# Altium schematic sheet RK3568-SOM-DDR3_MEM.SchDoc
size A2; DocumentNumber: 3; SheetNumber: 3; SheetTotal: 31
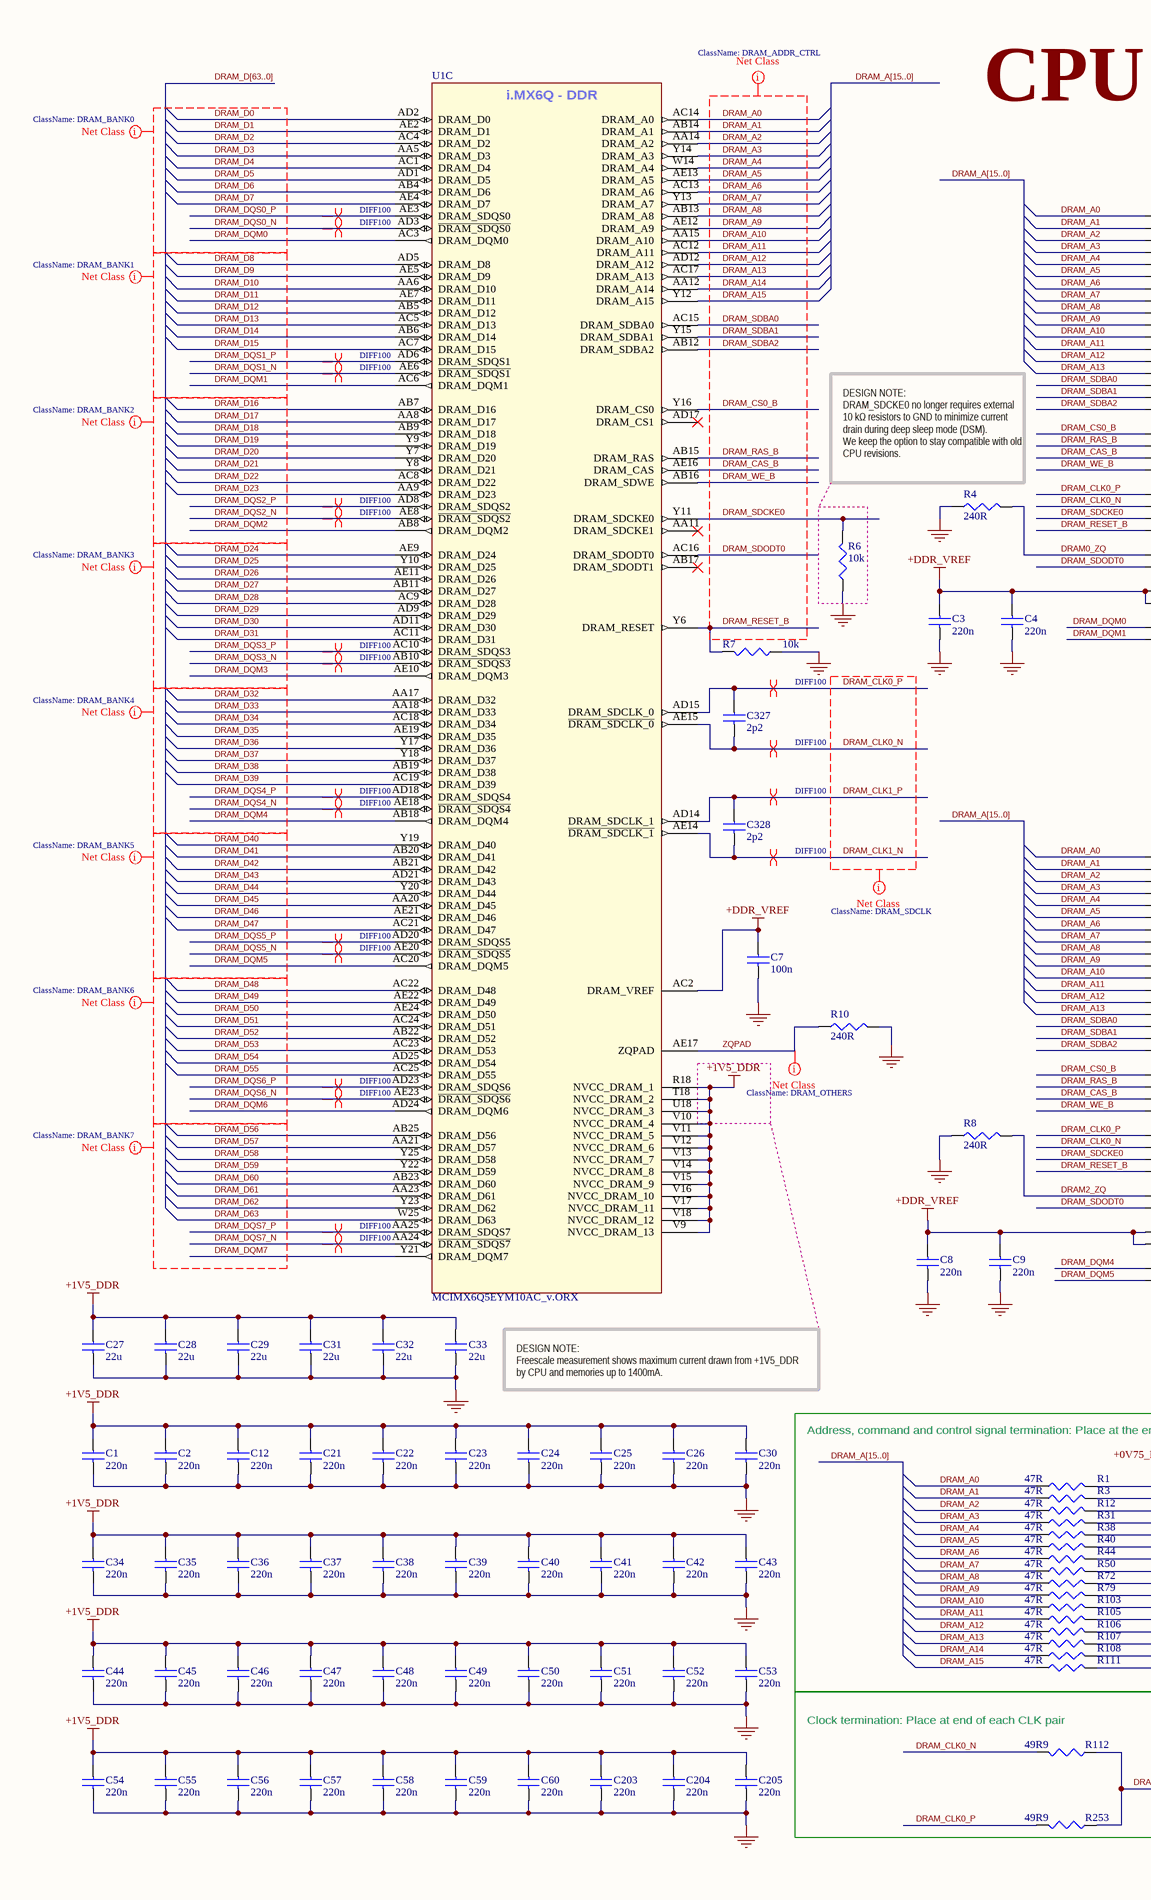
[diagram p0: RK3568-SOM-DDR3_MEM.SchDoc, left]
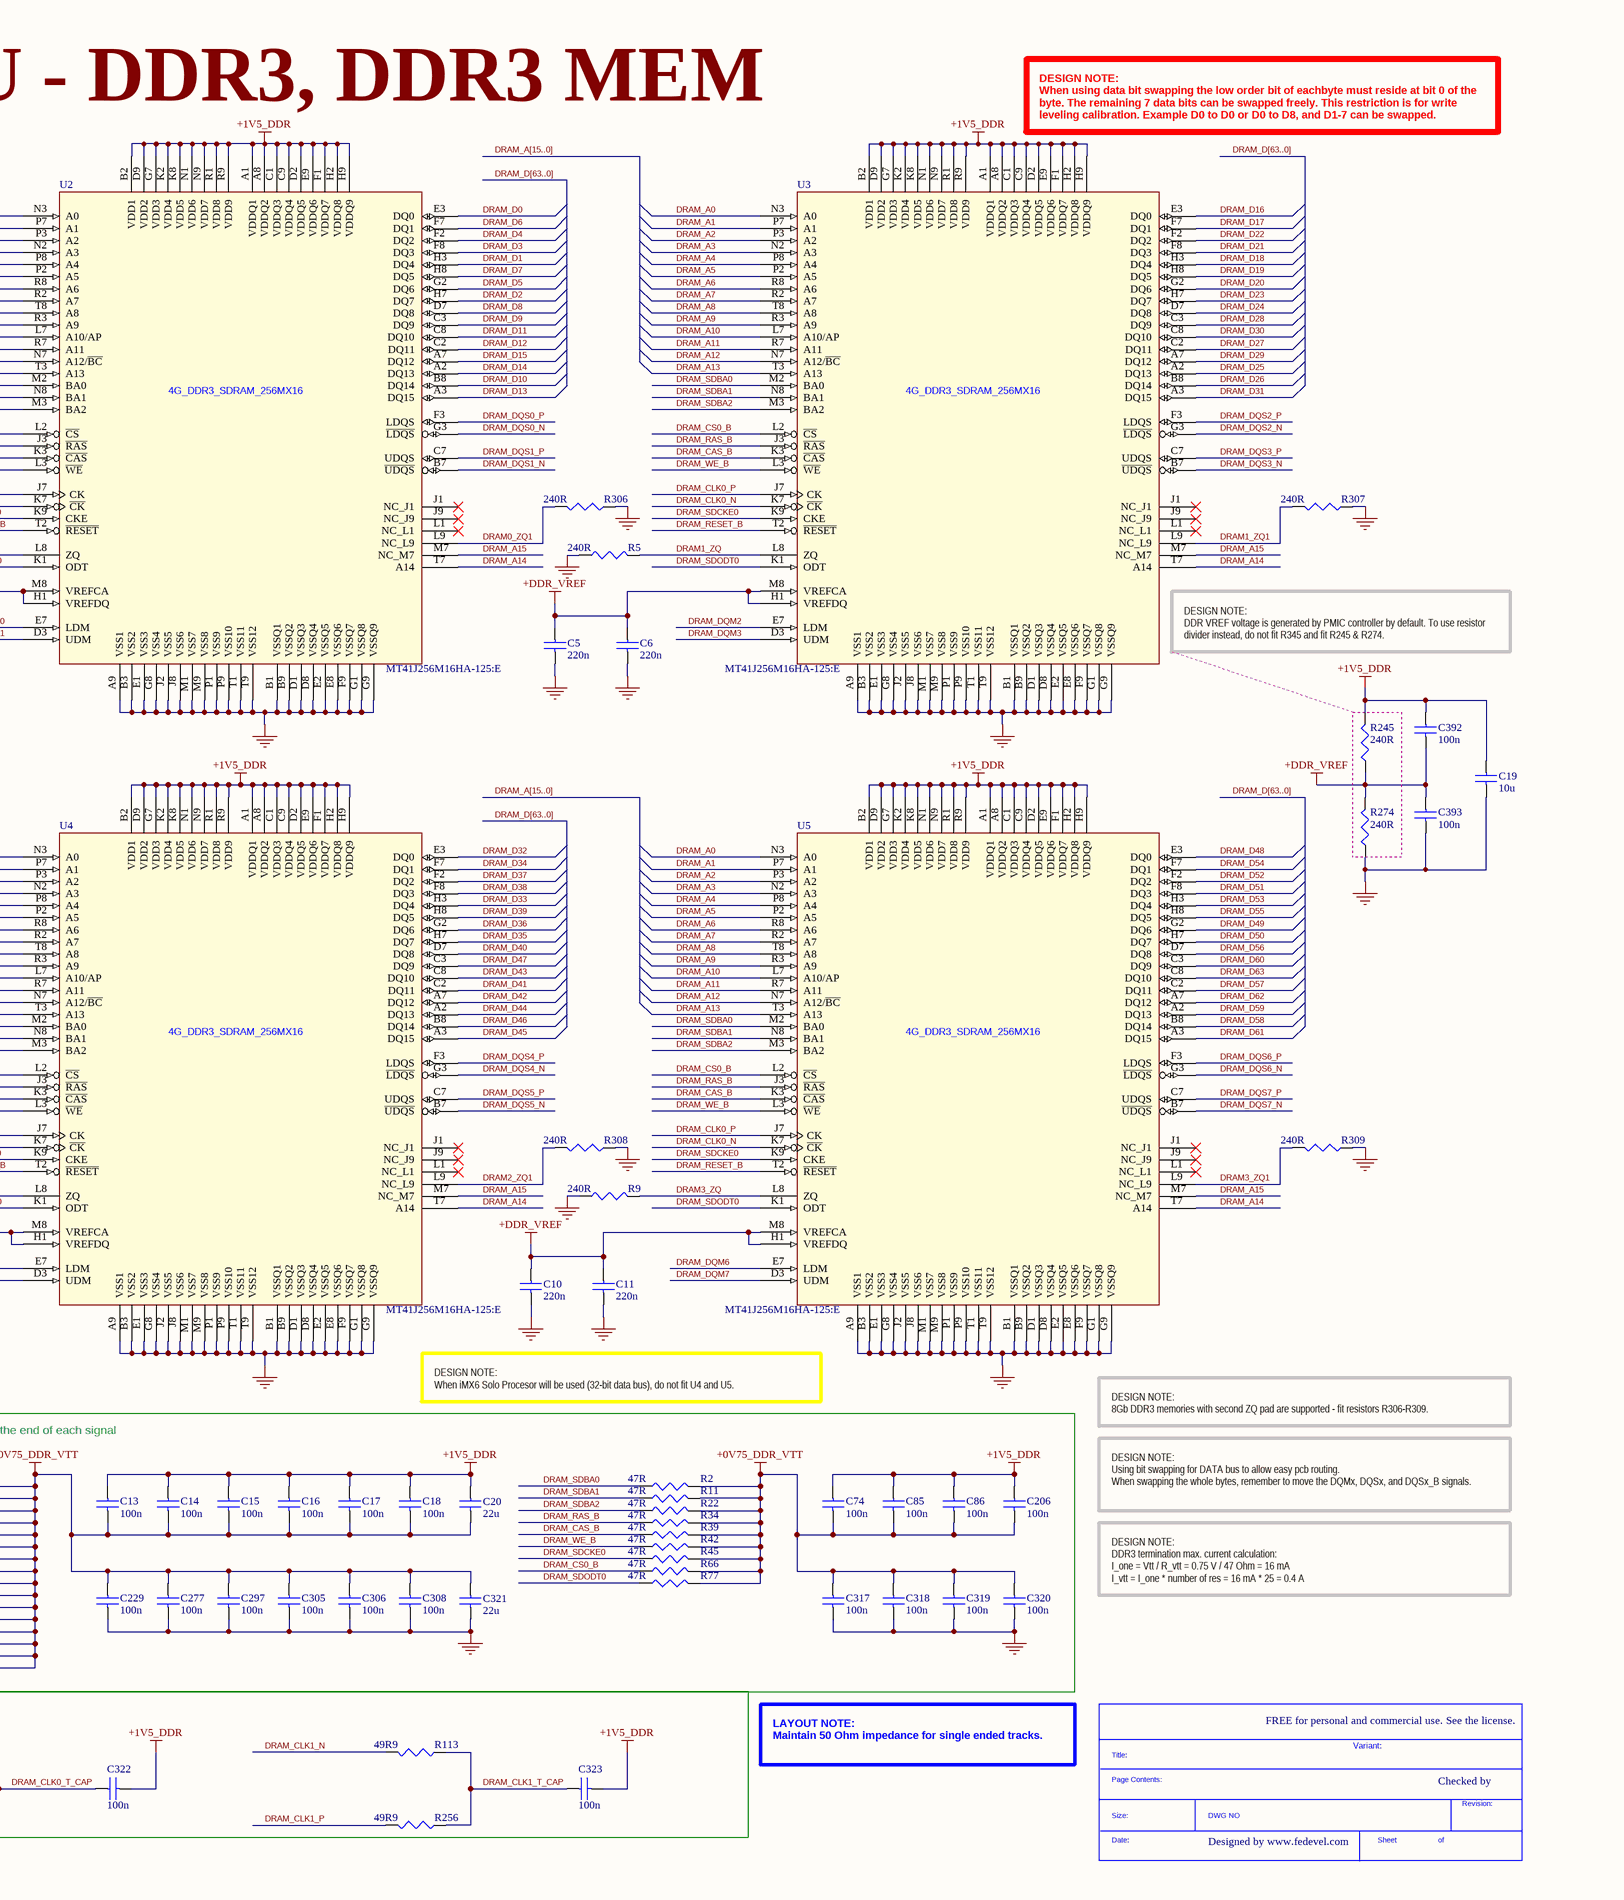
[diagram p1: RK3568-SOM-DDR3_MEM.SchDoc, right]

## Parts
*  SDTitleBlock  (value not drawn)  (graphical)
C1  220n  [C0201]
C2  220n  [C0201]
C3  220n  [C0201]
C4  220n  [C0201]
C5  220n  [C0201]
C6  220n  [C0201]
C7  100n  [C0201]
C8  220n  [C0201]
C9  220n  [C0201]
C10  220n  [C0201]
C11  220n  [C0201]
C12  220n  [C0201]
C13  100n  [C0201]
C14  100n  [C0201]
C15  100n  [C0201]
C16  100n  [C0201]
C17  100n  [C0201]
C18  100n  [C0201]
C19  10u  [C0603]
C20  22u  [C0603]
C21  220n  [C0201]
C22  220n  [C0201]
C23  220n  [C0201]
C24  220n  [C0201]
C25  220n  [C0201]
C26  220n  [C0201]
C27  22u  [C0603]
C28  22u  [C0603]
C29  22u  [C0603]
C30  220n  [C0201]
C31  22u  [C0603]
C32  22u  [C0603]
C33  22u  [C0603]
C34  220n  [C0201]
C35  220n  [C0201]
C36  220n  [C0201]
C37  220n  [C0201]
C38  220n  [C0201]
C39  220n  [C0201]
C40  220n  [C0201]
C41  220n  [C0201]
C42  220n  [C0201]
C43  220n  [C0201]
C44  220n  [C0201]
C45  220n  [C0201]
C46  220n  [C0201]
C47  220n  [C0201]
C48  220n  [C0201]
C49  220n  [C0201]
C50  220n  [C0201]
C51  220n  [C0201]
C52  220n  [C0201]
C53  220n  [C0201]
C54  220n  [C0201]
C55  220n  [C0201]
C56  220n  [C0201]
C57  220n  [C0201]
C58  220n  [C0201]
C59  220n  [C0201]
C60  220n  [C0201]
C74  100n  [C0201]
C85  100n  [C0201]
C86  100n  [C0201]
C203  220n  [C0201]
C204  220n  [C0201]
C205  220n  [C0201]
C206  100n  [C0201]
C229  100n  [C0201]
C277  100n  [C0201]
C297  100n  [C0201]
C305  100n  [C0201]
C306  100n  [C0201]
C308  100n  [C0201]
C317  100n  [C0201]
C318  100n  [C0201]
C319  100n  [C0201]
C320  100n  [C0201]
C321  22u  [C0603]
C322  100n  [C0201]
C323  100n  [C0201]
C327  2p2  [C0201]
C328  2p2  [C0201]
C392  100n  [C0402]
C393  100n  [C0402]
R1  47R  [R0201]
R2  47R  [R0201]
R3  47R  [R0201]
R4  240R  [R0201]
R5  240R  [R0201]
R6  10k  [R0201]
R7  10k  [R0201]
R8  240R  [R0201]
R9  240R  [R0201]
R10  240R  [R0201]
R11  47R  [R0201]
R12  47R  [R0201]
R22  47R  [R0201]
R31  47R  [R0201]
R34  47R  [R0201]
R38  47R  [R0201]
R39  47R  [R0201]
R40  47R  [R0201]
R42  47R  [R0201]
R44  47R  [R0201]
R45  47R  [R0201]
R50  47R  [R0201]
R66  47R  [R0201]
R72  47R  [R0201]
R77  47R  [R0201]
R79  47R  [R0201]
R103  47R  [R0201]
R105  47R  [R0201]
R106  47R  [R0201]
R107  47R  [R0201]
R108  47R  [R0201]
R111  47R  [R0201]
R112  49R9  [R0201]
R113  49R9  [R0201]
R245  240R  [R0402]
R253  49R9  [R0201]
R256  49R9  [R0201]
R274  240R  [R0402]
R306  240R  [R0201]
R307  240R  [R0201]
R308  240R  [R0201]
R309  240R  [R0201]
U1  MCIMX6Q5EYM10AC_v.ORX  [PBGA624]  (part C of 21)
U2  MT41J256M16HA-125:E  [96_FPGA_DD3_14mmx10mm-small_size]
U3  MT41J256M16HA-125:E  [96_FPGA_DD3_14mmx10mm-small_size]
U4  MT41J256M16HA-125:E  [96_FPGA_DD3_14mmx10mm-small_size]
U5  MT41J256M16HA-125:E  [96_FPGA_DD3_14mmx10mm-small_size]

## Blocks framed on the sheet
Clock termination: Place at end of each CLK pair: C322 C323 R112 R113 R253 R256

## Nets
+0V75_DDR_VTT: C13.2 C14.2 C15.2 C16.2 C17.2 C18.2 C20.2 C74.2 C85.2 C86.2 C206.2 C229.1 C277.1 C297.1 C305.1 C306.1 C308.1 C317.1 C318.1 C319.1 C320.1 C321.1 R1.2 R2.2 R3.2 R11.2 R12.2 R22.2 R31.2 R34.2 R38.2 R39.2 R40.2 R42.2 R44.2 R45.2 R50.2 R66.2 R72.2 R77.2 R79.2 R103.2 R105.2 R106.2 R107.2 R108.2 R111.2
+1V5_DDR: C1.1 C2.1 C12.1 C13.1 C14.1 C15.1 C16.1 C17.1 C18.1 C19.1 C20.1 C21.1 C22.1 C23.1 C24.1 C25.1 C26.1 C27.1 C28.1 C29.1 C30.1 C31.1 C32.1 C33.1 C34.1 C35.1 C36.1 C37.1 C38.1 C39.1 C40.1 C41.1 C42.1 C43.1 C44.1 C45.1 C46.1 C47.1 C48.1 C49.1 C50.1 C51.1 C52.1 C53.1 C54.1 C55.1 C56.1 C57.1 C58.1 C59.1 C60.1 C74.1 C85.1 C86.1 C203.1 C204.1 C205.1 C206.1 C322.2 C323.2 C392.1 R245.2 U1.R18(NVCC_DRAM_1) U1.T18(NVCC_DRAM_2) U1.U18(NVCC_DRAM_3) U1.V9(NVCC_DRAM_13) U1.V10(NVCC_DRAM_4) U1.V11(NVCC_DRAM_5) U1.V12(NVCC_DRAM_6) U1.V13(NVCC_DRAM_7) U1.V14(NVCC_DRAM_8) U1.V15(NVCC_DRAM_9) U1.V16(NVCC_DRAM_10) U1.V17(NVCC_DRAM_11) U1.V18(NVCC_DRAM_12) U2.A1(VDDQ1) U2.A8(VDDQ2) U2.B2(VDD1) U2.C1(VDDQ3) U2.C9(VDDQ4) U2.D2(VDDQ5) U2.D9(VDD2) U2.E9(VDDQ6) U2.F1(VDDQ7) U2.G7(VDD3) U2.H2(VDDQ8) U2.H9(VDDQ9) U2.K2(VDD4) U2.K8(VDD5) U2.N1(VDD6) U2.N9(VDD7) U2.R1(VDD8) U2.R9(VDD9) U3.A1(VDDQ1) U3.A8(VDDQ2) U3.B2(VDD1) U3.C1(VDDQ3) U3.C9(VDDQ4) U3.D2(VDDQ5) U3.D9(VDD2) U3.E9(VDDQ6) U3.F1(VDDQ7) U3.G7(VDD3) U3.H2(VDDQ8) U3.H9(VDDQ9) U3.K2(VDD4) U3.K8(VDD5) U3.N1(VDD6) U3.N9(VDD7) U3.R1(VDD8) U3.R9(VDD9) U4.A1(VDDQ1) U4.A8(VDDQ2) U4.B2(VDD1) U4.C1(VDDQ3) U4.C9(VDDQ4) U4.D2(VDDQ5) U4.D9(VDD2) U4.E9(VDDQ6) U4.F1(VDDQ7) U4.G7(VDD3) U4.H2(VDDQ8) U4.H9(VDDQ9) U4.K2(VDD4) U4.K8(VDD5) U4.N1(VDD6) U4.N9(VDD7) U4.R1(VDD8) U4.R9(VDD9) U5.A1(VDDQ1) U5.A8(VDDQ2) U5.B2(VDD1) U5.C1(VDDQ3) U5.C9(VDDQ4) U5.D2(VDDQ5) U5.D9(VDD2) U5.E9(VDDQ6) U5.F1(VDDQ7) U5.G7(VDD3) U5.H2(VDDQ8) U5.H9(VDDQ9) U5.K2(VDD4) U5.K8(VDD5) U5.N1(VDD6) U5.N9(VDD7) U5.R1(VDD8) U5.R9(VDD9)
+DDR_VREF: C3.1 C4.1 C5.1 C6.1 C7.1 C8.1 C9.1 C10.1 C11.1 C392.2 C393.1 R245.1 R274.2 U1.AC2(DRAM_VREF) U2.H1(VREFDQ) U2.M8(VREFCA) U3.H1(VREFDQ) U3.M8(VREFCA) U4.H1(VREFDQ) U4.M8(VREFCA) U5.H1(VREFDQ) U5.M8(VREFCA)
GND: C1.2 C2.2 C3.2 C4.2 C5.2 C6.2 C7.2 C8.2 C9.2 C10.2 C11.2 C12.2 C19.2 C21.2 C22.2 C23.2 C24.2 C25.2 C26.2 C27.2 C28.2 C29.2 C30.2 C31.2 C32.2 C33.2 C34.2 C35.2 C36.2 C37.2 C38.2 C39.2 C40.2 C41.2 C42.2 C43.2 C44.2 C45.2 C46.2 C47.2 C48.2 C49.2 C50.2 C51.2 C52.2 C53.2 C54.2 C55.2 C56.2 C57.2 C58.2 C59.2 C60.2 C203.2 C204.2 C205.2 C229.2 C277.2 C297.2 C305.2 C306.2 C308.2 C317.2 C318.2 C319.2 C320.2 C321.2 C393.2 R4.1 R5.1 R6.1 R7.1 R8.1 R9.1 R10.2 R274.1 R306.1 R307.1 R308.1 R309.1 U2.A9(VSS1) U2.B1(VSSQ1) U2.B3(VSS2) U2.B9(VSSQ2) U2.D1(VSSQ3) U2.D8(VSSQ4) U2.E1(VSS3) U2.E2(VSSQ5) U2.E8(VSSQ6) U2.F9(VSSQ7) U2.G1(VSSQ8) U2.G8(VSS4) U2.G9(VSSQ9) U2.J2(VSS5) U2.J8(VSS6) U2.M1(VSS7) U2.M9(VSS8) U2.P1(VSS9) U2.P9(VSS10) U2.T1(VSS11) U2.T9(VSS12) U3.A9(VSS1) U3.B1(VSSQ1) U3.B3(VSS2) U3.B9(VSSQ2) U3.D1(VSSQ3) U3.D8(VSSQ4) U3.E1(VSS3) U3.E2(VSSQ5) U3.E8(VSSQ6) U3.F9(VSSQ7) U3.G1(VSSQ8) U3.G8(VSS4) U3.G9(VSSQ9) U3.J2(VSS5) U3.J8(VSS6) U3.M1(VSS7) U3.M9(VSS8) U3.P1(VSS9) U3.P9(VSS10) U3.T1(VSS11) U3.T9(VSS12) U4.A9(VSS1) U4.B1(VSSQ1) U4.B3(VSS2) U4.B9(VSSQ2) U4.D1(VSSQ3) U4.D8(VSSQ4) U4.E1(VSS3) U4.E2(VSSQ5) U4.E8(VSSQ6) U4.F9(VSSQ7) U4.G1(VSSQ8) U4.G8(VSS4) U4.G9(VSSQ9) U4.J2(VSS5) U4.J8(VSS6) U4.M1(VSS7) U4.M9(VSS8) U4.P1(VSS9) U4.P9(VSS10) U4.T1(VSS11) U4.T9(VSS12) U5.A9(VSS1) U5.B1(VSSQ1) U5.B3(VSS2) U5.B9(VSSQ2) U5.D1(VSSQ3) U5.D8(VSSQ4) U5.E1(VSS3) U5.E2(VSSQ5) U5.E8(VSSQ6) U5.F9(VSSQ7) U5.G1(VSSQ8) U5.G8(VSS4) U5.G9(VSSQ9) U5.J2(VSS5) U5.J8(VSS6) U5.M1(VSS7) U5.M9(VSS8) U5.P1(VSS9) U5.P9(VSS10) U5.T1(VSS11) U5.T9(VSS12)
DRAM0_ZQ: R4.2 U2.L8(ZQ)
DRAM0_ZQ1: R306.2 U2.L9(NC_L9)
DRAM1_ZQ: R5.2 U3.L8(ZQ)
DRAM1_ZQ1: R307.2 U3.L9(NC_L9)
DRAM2_ZQ: R8.2 U4.L8(ZQ)
DRAM2_ZQ1: R308.2 U4.L9(NC_L9)
DRAM3_ZQ: R9.2 U5.L8(ZQ)
DRAM3_ZQ1: R309.2 U5.L9(NC_L9)
DRAM_A0: R1.1 U1.AC14(DRAM_A0) U2.N3(A0) U3.N3(A0) U4.N3(A0) U5.N3(A0)
DRAM_A1: R3.1 U1.AB14(DRAM_A1) U2.P7(A1) U3.P7(A1) U4.P7(A1) U5.P7(A1)
DRAM_A2: R12.1 U1.AA14(DRAM_A2) U2.P3(A2) U3.P3(A2) U4.P3(A2) U5.P3(A2)
DRAM_A3: R31.1 U1.Y14(DRAM_A3) U2.N2(A3) U3.N2(A3) U4.N2(A3) U5.N2(A3)
DRAM_A4: R38.1 U1.W14(DRAM_A4) U2.P8(A4) U3.P8(A4) U4.P8(A4) U5.P8(A4)
DRAM_A5: R40.1 U1.AE13(DRAM_A5) U2.P2(A5) U3.P2(A5) U4.P2(A5) U5.P2(A5)
DRAM_A6: R44.1 U1.AC13(DRAM_A6) U2.R8(A6) U3.R8(A6) U4.R8(A6) U5.R8(A6)
DRAM_A7: R50.1 U1.Y13(DRAM_A7) U2.R2(A7) U3.R2(A7) U4.R2(A7) U5.R2(A7)
DRAM_A8: R72.1 U1.AB13(DRAM_A8) U2.T8(A8) U3.T8(A8) U4.T8(A8) U5.T8(A8)
DRAM_A9: R79.1 U1.AE12(DRAM_A9) U2.R3(A9) U3.R3(A9) U4.R3(A9) U5.R3(A9)
DRAM_A10: R103.1 U1.AA15(DRAM_A10) U2.L7(A10/AP) U3.L7(A10/AP) U4.L7(A10/AP) U5.L7(A10/AP)
DRAM_A11: R105.1 U1.AC12(DRAM_A11) U2.R7(A11) U3.R7(A11) U4.R7(A11) U5.R7(A11)
DRAM_A12: R106.1 U1.AD12(DRAM_A12) U2.N7(A12/~{BC}) U3.N7(A12/~{BC}) U4.N7(A12/~{BC}) U5.N7(A12/~{BC})
DRAM_A13: R107.1 U1.AC17(DRAM_A13) U2.T3(A13) U3.T3(A13) U4.T3(A13) U5.T3(A13)
DRAM_A14: R108.1 U1.AA12(DRAM_A14) U2.T7(A14) U3.T7(A14) U4.T7(A14) U5.T7(A14)
DRAM_A15: R111.1 U1.Y12(DRAM_A15) U2.M7(NC_M7) U3.M7(NC_M7) U4.M7(NC_M7) U5.M7(NC_M7)
DRAM_CAS_B: R39.1 U1.AE16(DRAM_CAS) U2.K3(~{CAS}) U3.K3(~{CAS}) U4.K3(~{CAS}) U5.K3(~{CAS})
DRAM_CLK0_N: C327.2 R112.2 U1.AE15(~{DRAM_SDCLK_0}) U2.K7(~{CK}) U3.K7(~{CK}) U4.K7(~{CK}) U5.K7(~{CK})
DRAM_CLK0_P: C327.1 R253.2 U1.AD15(DRAM_SDCLK_0) U2.J7(CK) U3.J7(CK) U4.J7(CK) U5.J7(CK)
DRAM_CLK0_T_CAP: C322.1 R112.1 R253.1
DRAM_CLK1_N: C328.2 R113.2 U1.AE14(~{DRAM_SDCLK_1})
DRAM_CLK1_P: C328.1 R256.2 U1.AD14(DRAM_SDCLK_1)
DRAM_CLK1_T_CAP: C323.1 R113.1 R256.1
DRAM_CS0_B: R66.1 U1.Y16(DRAM_CS0) U2.L2(~{CS}) U3.L2(~{CS}) U4.L2(~{CS}) U5.L2(~{CS})
DRAM_D0: U1.AD2(DRAM_D0) U2.E3(DQ0)
DRAM_D1: U1.AE2(DRAM_D1) U2.H3(DQ4)
DRAM_D2: U1.AC4(DRAM_D2) U2.H7(DQ7)
DRAM_D3: U1.AA5(DRAM_D3) U2.F8(DQ3)
DRAM_D4: U1.AC1(DRAM_D4) U2.F2(DQ2)
DRAM_D5: U1.AD1(DRAM_D5) U2.G2(DQ6)
DRAM_D6: U1.AB4(DRAM_D6) U2.F7(DQ1)
DRAM_D7: U1.AE4(DRAM_D7) U2.H8(DQ5)
DRAM_D8: U1.AD5(DRAM_D8) U2.D7(DQ8)
DRAM_D9: U1.AE5(DRAM_D9) U2.C3(DQ9)
DRAM_D10: U1.AA6(DRAM_D10) U2.B8(DQ14)
DRAM_D11: U1.AE7(DRAM_D11) U2.C8(DQ10)
DRAM_D12: U1.AB5(DRAM_D12) U2.C2(DQ11)
DRAM_D13: U1.AC5(DRAM_D13) U2.A3(DQ15)
DRAM_D14: U1.AB6(DRAM_D14) U2.A2(DQ13)
DRAM_D15: U1.AC7(DRAM_D15) U2.A7(DQ12)
DRAM_D16: U1.AB7(DRAM_D16) U3.E3(DQ0)
DRAM_D17: U1.AA8(DRAM_D17) U3.F7(DQ1)
DRAM_D18: U1.AB9(DRAM_D18) U3.H3(DQ4)
DRAM_D19: U1.Y9(DRAM_D19) U3.H8(DQ5)
DRAM_D20: U1.Y7(DRAM_D20) U3.G2(DQ6)
DRAM_D21: U1.Y8(DRAM_D21) U3.F8(DQ3)
DRAM_D22: U1.AC8(DRAM_D22) U3.F2(DQ2)
DRAM_D23: U1.AA9(DRAM_D23) U3.H7(DQ7)
DRAM_D24: U1.AE9(DRAM_D24) U3.D7(DQ8)
DRAM_D25: U1.Y10(DRAM_D25) U3.A2(DQ13)
DRAM_D26: U1.AE11(DRAM_D26) U3.B8(DQ14)
DRAM_D27: U1.AB11(DRAM_D27) U3.C2(DQ11)
DRAM_D28: U1.AC9(DRAM_D28) U3.C3(DQ9)
DRAM_D29: U1.AD9(DRAM_D29) U3.A7(DQ12)
DRAM_D30: U1.AD11(DRAM_D30) U3.C8(DQ10)
DRAM_D31: U1.AC11(DRAM_D31) U3.A3(DQ15)
DRAM_D32: U1.AA17(DRAM_D32) U4.E3(DQ0)
DRAM_D33: U1.AA18(DRAM_D33) U4.H3(DQ4)
DRAM_D34: U1.AC18(DRAM_D34) U4.F7(DQ1)
DRAM_D35: U1.AE19(DRAM_D35) U4.H7(DQ7)
DRAM_D36: U1.Y17(DRAM_D36) U4.G2(DQ6)
DRAM_D37: U1.Y18(DRAM_D37) U4.F2(DQ2)
DRAM_D38: U1.AB19(DRAM_D38) U4.F8(DQ3)
DRAM_D39: U1.AC19(DRAM_D39) U4.H8(DQ5)
DRAM_D40: U1.Y19(DRAM_D40) U4.D7(DQ8)
DRAM_D41: U1.AB20(DRAM_D41) U4.C2(DQ11)
DRAM_D42: U1.AB21(DRAM_D42) U4.A7(DQ12)
DRAM_D43: U1.AD21(DRAM_D43) U4.C8(DQ10)
DRAM_D44: U1.Y20(DRAM_D44) U4.A2(DQ13)
DRAM_D45: U1.AA20(DRAM_D45) U4.A3(DQ15)
DRAM_D46: U1.AE21(DRAM_D46) U4.B8(DQ14)
DRAM_D47: U1.AC21(DRAM_D47) U4.C3(DQ9)
DRAM_D48: U1.AC22(DRAM_D48) U5.E3(DQ0)
DRAM_D49: U1.AE22(DRAM_D49) U5.G2(DQ6)
DRAM_D50: U1.AE24(DRAM_D50) U5.H7(DQ7)
DRAM_D51: U1.AC24(DRAM_D51) U5.F8(DQ3)
DRAM_D52: U1.AB22(DRAM_D52) U5.F2(DQ2)
DRAM_D53: U1.AC23(DRAM_D53) U5.H3(DQ4)
DRAM_D54: U1.AD25(DRAM_D54) U5.F7(DQ1)
DRAM_D55: U1.AC25(DRAM_D55) U5.H8(DQ5)
DRAM_D56: U1.AB25(DRAM_D56) U5.D7(DQ8)
DRAM_D57: U1.AA21(DRAM_D57) U5.C2(DQ11)
DRAM_D58: U1.Y25(DRAM_D58) U5.B8(DQ14)
DRAM_D59: U1.Y22(DRAM_D59) U5.A2(DQ13)
DRAM_D60: U1.AB23(DRAM_D60) U5.C3(DQ9)
DRAM_D61: U1.AA23(DRAM_D61) U5.A3(DQ15)
DRAM_D62: U1.Y23(DRAM_D62) U5.A7(DQ12)
DRAM_D63: U1.W25(DRAM_D63) U5.C8(DQ10)
DRAM_DQM0: U1.AC3(DRAM_DQM0) U2.E7(LDM)
DRAM_DQM1: U1.AC6(DRAM_DQM1) U2.D3(UDM)
DRAM_DQM2: U1.AB8(DRAM_DQM2) U3.E7(LDM)
DRAM_DQM3: U1.AE10(DRAM_DQM3) U3.D3(UDM)
DRAM_DQM4: U1.AB18(DRAM_DQM4) U4.E7(LDM)
DRAM_DQM5: U1.AC20(DRAM_DQM5) U4.D3(UDM)
DRAM_DQM6: U1.AD24(DRAM_DQM6) U5.E7(LDM)
DRAM_DQM7: U1.Y21(DRAM_DQM7) U5.D3(UDM)
DRAM_DQS0_N: U1.AD3(~{DRAM_SDQS0}) U2.G3(~{LDQS})
DRAM_DQS0_P: U1.AE3(DRAM_SDQS0) U2.F3(LDQS)
DRAM_DQS1_N: U1.AE6(~{DRAM_SDQS1}) U2.B7(~{UDQS})
DRAM_DQS1_P: U1.AD6(DRAM_SDQS1) U2.C7(UDQS)
DRAM_DQS2_N: U1.AE8(~{DRAM_SDQS2}) U3.G3(~{LDQS})
DRAM_DQS2_P: U1.AD8(DRAM_SDQS2) U3.F3(LDQS)
DRAM_DQS3_N: U1.AB10(~{DRAM_SDQS3}) U3.B7(~{UDQS})
DRAM_DQS3_P: U1.AC10(DRAM_SDQS3) U3.C7(UDQS)
DRAM_DQS4_N: U1.AE18(~{DRAM_SDQS4}) U4.G3(~{LDQS})
DRAM_DQS4_P: U1.AD18(DRAM_SDQS4) U4.F3(LDQS)
DRAM_DQS5_N: U1.AE20(~{DRAM_SDQS5}) U4.B7(~{UDQS})
DRAM_DQS5_P: U1.AD20(DRAM_SDQS5) U4.C7(UDQS)
DRAM_DQS6_N: U1.AE23(~{DRAM_SDQS6}) U5.G3(~{LDQS})
DRAM_DQS6_P: U1.AD23(DRAM_SDQS6) U5.F3(LDQS)
DRAM_DQS7_N: U1.AA24(~{DRAM_SDQS7}) U5.B7(~{UDQS})
DRAM_DQS7_P: U1.AA25(DRAM_SDQS7) U5.C7(UDQS)
DRAM_RAS_B: R34.1 U1.AB15(DRAM_RAS) U2.J3(~{RAS}) U3.J3(~{RAS}) U4.J3(~{RAS}) U5.J3(~{RAS})
DRAM_RESET_B: R7.2 U1.Y6(DRAM_RESET) U2.T2(~{RESET}) U3.T2(~{RESET}) U4.T2(~{RESET}) U5.T2(~{RESET})
DRAM_SDBA0: R2.1 U1.AC15(DRAM_SDBA0) U2.M2(BA0) U3.M2(BA0) U4.M2(BA0) U5.M2(BA0)
DRAM_SDBA1: R11.1 U1.Y15(DRAM_SDBA1) U2.N8(BA1) U3.N8(BA1) U4.N8(BA1) U5.N8(BA1)
DRAM_SDBA2: R22.1 U1.AB12(DRAM_SDBA2) U2.M3(BA2) U3.M3(BA2) U4.M3(BA2) U5.M3(BA2)
DRAM_SDCKE0: R6.2 R45.1 U1.Y11(DRAM_SDCKE0) U2.K9(CKE) U3.K9(CKE) U4.K9(CKE) U5.K9(CKE)
DRAM_SDODT0: R77.1 U1.AC16(DRAM_SDODT0) U2.K1(ODT) U3.K1(ODT) U4.K1(ODT) U5.K1(ODT)
DRAM_WE_B: R42.1 U1.AB16(DRAM_SDWE) U2.L3(~{WE}) U3.L3(~{WE}) U4.L3(~{WE}) U5.L3(~{WE})
ZQPAD: R10.1 U1.AE17(ZQPAD)

Not connected (* = marked no-connect by the designer): U1 AA11(DRAM_SDCKE1)* AB17(DRAM_SDODT1)* AD17(DRAM_CS1)*; U2 J1(NC_J1)* J9(NC_J9)* L1(NC_L1)*; U3 J1(NC_J1)* J9(NC_J9)* L1(NC_L1)*; U4 J1(NC_J1)* J9(NC_J9)* L1(NC_L1)*; U5 J1(NC_J1)* J9(NC_J9)* L1(NC_L1)*

## Buses and harness runs
bus DRAM_A[15..0]
bus DRAM_D[63..0]

## Layout directives
net class DRAM_BANK0: DRAM_D0, DRAM_D1, DRAM_D2, DRAM_D3, DRAM_D4, DRAM_D5, DRAM_D6, DRAM_D7, DRAM_DQM0, DRAM_DQS0_N, DRAM_DQS0_P
net class DRAM_BANK1: DRAM_D8, DRAM_D9, DRAM_D10, DRAM_D11, DRAM_D12, DRAM_D13, DRAM_D14, DRAM_D15, DRAM_DQM1, DRAM_DQS1_N, DRAM_DQS1_P
net class DRAM_BANK2: DRAM_D16, DRAM_D17, DRAM_D18, DRAM_D19, DRAM_D20, DRAM_D21, DRAM_D22, DRAM_D23, DRAM_DQM2, DRAM_DQS2_N, DRAM_DQS2_P
net class DRAM_BANK3: DRAM_D24, DRAM_D25, DRAM_D26, DRAM_D27, DRAM_D28, DRAM_D29, DRAM_D30, DRAM_D31, DRAM_DQM3, DRAM_DQS3_N, DRAM_DQS3_P
net class DRAM_BANK4: DRAM_D32, DRAM_D33, DRAM_D34, DRAM_D35, DRAM_D36, DRAM_D37, DRAM_D38, DRAM_D39, DRAM_DQM4, DRAM_DQS4_N, DRAM_DQS4_P
net class DRAM_BANK5: DRAM_D40, DRAM_D41, DRAM_D42, DRAM_D43, DRAM_D44, DRAM_D45, DRAM_D46, DRAM_D47, DRAM_DQM5, DRAM_DQS5_N, DRAM_DQS5_P
net class DRAM_BANK6: DRAM_D48, DRAM_D49, DRAM_D50, DRAM_D51, DRAM_D52, DRAM_D53, DRAM_D54, DRAM_D55, DRAM_DQM6, DRAM_DQS6_N, DRAM_DQS6_P
net class DRAM_BANK7: DRAM_D56, DRAM_D57, DRAM_D58, DRAM_D59, DRAM_D60, DRAM_D61, DRAM_D62, DRAM_D63, DRAM_DQM7, DRAM_DQS7_N, DRAM_DQS7_P
differential pair; net class DIFF100: DRAM_CLK0_N, DRAM_CLK0_P, DRAM_CLK1_N, DRAM_CLK1_P, DRAM_DQS0_N, DRAM_DQS0_P, DRAM_DQS1_N, DRAM_DQS1_P, DRAM_DQS2_N, DRAM_DQS2_P, DRAM_DQS3_N, DRAM_DQS3_P, DRAM_DQS4_N, DRAM_DQS4_P, DRAM_DQS5_N, DRAM_DQS5_P, DRAM_DQS6_N, DRAM_DQS6_P, DRAM_DQS7_N, DRAM_DQS7_P
net class DRAM_ADDR_CTRL: DRAM_A0, DRAM_A1, DRAM_A2, DRAM_A3, DRAM_A4, DRAM_A5, DRAM_A6, DRAM_A7, DRAM_A8, DRAM_A9, DRAM_A10, DRAM_A11, DRAM_A12, DRAM_A13, DRAM_A14, DRAM_A15, DRAM_CAS_B, DRAM_CS0_B, DRAM_RAS_B, DRAM_RESET_B, DRAM_SDBA0, DRAM_SDBA1, DRAM_SDBA2, DRAM_SDCKE0, DRAM_SDODT0, DRAM_WE_B
net class DRAM_SDCLK: DRAM_CLK0_N, DRAM_CLK0_P, DRAM_CLK1_N, DRAM_CLK1_P
net class DRAM_OTHERS: ZQPAD

## Notes on the sheet
- CPU - DDR3, DDR3 MEM
- DESIGN NOTE:
  When using data bit swapping the low order bit of eachbyte must reside at bit 0 of the byte. The remaining 7 data bits can be swapped freely. This restriction is for write leveling calibration. Example D0 to D0 or D0 to D8, and D1-7 can be swapped.
- (near R4) DESIGN NOTE:
  DRAM_SDCKE0 no longer requires external 10 kΩ resistors to GND to minimize current drain during deep sleep mode (DSM).
  We keep the option to stay compatible with old CPU revisions.
- (near U3) DESIGN NOTE:
  DDR VREF voltage is generated by PMIC controller by default. To use resistor divider instead, do not fit R345 and fit R245 & R274.
- DESIGN NOTE:
  Freescale measurement shows maximum current drawn from +1V5_DDR by CPU and memories up to 1400mA.
- Address, command and control signal termination: Place at the end of each signal
- DESIGN NOTE:
  When iMX6 Solo Procesor will be used (32-bit data bus), do not fit U4 and U5.
- DESIGN NOTE:
  8Gb DDR3 memories with second ZQ pad are supported - fit resistors R306-R309.
- DESIGN NOTE:
  Using bit swapping for DATA bus to allow easy pcb routing.
  When swapping the whole bytes, remember to move the DQMx, DQSx, and DQSx_B signals.
- DESIGN NOTE:
  DDR3 termination max. current calculation:
  I_one = Vtt / R_vtt = 0.75 V / 47 Ohm = 16 mA
  I_vtt = I_one * number of res = 16 mA * 25 = 0.4 A
- FREE for personal and commercial use. See the license.
- (near *) LAYOUT NOTE:
  Maintain 50 Ohm impedance for single ended tracks.
- Variant:
- Checked by
- Designed by www.fedevel.com
- (in symbol MCIMX6Q5EYM10AC_v.ORX, part C) i.MX6Q - DDR
- (in symbol MT41J256M16HA-125:E) 4G_DDR3_SDRAM_256MX16
- (in symbol SDTitleBlock) Title:; Page Contents:; Revision:; Size:; DWG NO; Date:; Sheet; of

## Library data of the parts
C1-C6 C8-C12 C21-C26 C30 C34-C60 C203-C205 = C0603X5R0J224M030BB: CAP CER 0.22UF 6.3V 20% X5R 0201; Manufacturer: TDK Corporation; Capacitance: 0.22µF; .Checked PCB: MM; Supplier 1: Digi-Key; Manufacturer Part Number: C0603X5R0J224M030BB; RoHS: RoHS Compliant; Category: Capacitors; Stock 1: 205900; Pricing 1: 1=0.15, 10=0.102, 100=0.0485, 250=0.0408, 500=0.03418, 1000=0.0275, 5000=0.02325 (USD); Packaging: Cut Tape (CT); Tolerance: ±20%; Voltage - Rated: 6.3V; Temperature Coefficient: X5R; Mounting Type: Surface Mount, MLCC; Operating Temperature: -55°C ~ 85°C; Applications: General Purpose; Ratings: -; Package / Case: 0201 (0603 Metric); Size / Dimension: 0.024" L x 0.012" W (0.60mm x 0.30mm); Height - Seated (Max): -; Thickness (Max): 0.013" (0.33mm); Lead Spacing: -; Features: -; Lead Style: -; ComponentLink1URL: http://product.tdk.com/en/catalog/datasheets/mlcc_commercial_general_en.pdf; ComponentLink1Description: http://product.tdk.com/en/catalog/datasheets/mlcc_commercial_general_en.pdf; Supplier Part Number 1: 445-5929-1-ND; .Checked SCH: MM; .Creator: MM
C7 C13-C18 C74 C85 C86 C206 C229 C277 C297 C305 C306 C308 C317-C320 C322 C323 = C0603X5R1C104K030BC: CAP CER 0.1UF 16V 10% X5R 0201; Manufacturer: TDK Corporation; Capacitance: 0.1µF; .Creator: MM; Supplier 1: Digi-Key; Manufacturer Part Number: C0603X5R1C104K030BC; RoHS: RoHS Compliant; Category: Capacitors; Stock 1: 19491; Pricing 1: 1=0.1, 10=0.046, 100=0.0209, 250=0.01712, 500=0.01464, 1000=0.0114, 5000=0.0095 (USD); Packaging: Cut Tape (CT); Tolerance: ±10%; Voltage - Rated: 16V; Temperature Coefficient: X5R; Mounting Type: Surface Mount, MLCC; Operating Temperature: -55°C ~ 85°C; Applications: General Purpose; Ratings: -; Package / Case: 0201 (0603 Metric); Size / Dimension: 0.024" L x 0.012" W (0.60mm x 0.30mm); Height - Seated (Max): -; Thickness (Max): 0.013" (0.33mm); Lead Spacing: -; Features: -; Lead Style: -; ComponentLink1URL: http://product.tdk.com/en/catalog/datasheets/mlcc_commercial_general_en.pdf; ComponentLink1Description: http://product.tdk.com/en/catalog/datasheets/mlcc_commercial_general_en.pdf; Supplier Part Number 1: 445-7313-1-ND; .Checked PCB: MM; .Checked SCH: MM
C19 = C1608X5R0J106M: CAP CER 10UF 6.3V X5R 20% 0603; Manufacturer: TDK Corporation; Capacitance: 10µF; Value: 10µF; .Checked PCB: used; Category: Capacitors; Supplier Part Number: 445-4112-1-ND; Manufacturer Part Number: C1608X5R0J106M; Operating Temperature: -55°C ~ 85°C; Package / Case: 0603 (1608 Metric); Price 1k [$]: 0.08580; .Checked SCH: used; Voltage - Rated: 6.3V; Features: Low ESR; Supplier: Digikey; Supplier 1: Digi-Key; Supplier Part Number 1: 445-4112-1-ND; RoHS: RoHS Compliant; Stock 1: 48157; Pricing 1: 1=0.46, 10=0.363, 100=0.1898, 250=0.14024, 500=0.1089, 1000=0.0858 (USD); Tolerance: ±20%; Temperature Coefficient: X5R; Mounting Type: Surface Mount, MLCC; Applications: General Purpose; Ratings: -; Size / Dimension: 0.063" L x 0.031" W (1.60mm x 0.80mm); Height - Seated (Max): -; Thickness (Max): 0.037" (0.95mm); Lead Spacing: -; Packaging: Cut Tape (CT); Lead Style: -; ComponentLink1URL: http://www.tdk.com/pdf/general_B11.pdf; ComponentLink1Description: http://www.tdk.com/pdf/general_B11.pdf
C20 C27-C29 C31-C33 C321 = GRM188R60G226MEA0L: CAP CER 22UF 4V 20% X5R 0603; Manufacturer: Murata Electronics North America; Capacitance: 22µF; .Checked PCB: used; .Creator: MM; Supplier 1: Digi-Key; Supplier Part Number 1: 490-5526-1-ND; Manufacturer Part Number: GRM188R60G226MEA0L; RoHS: RoHS Compliant; Category: Capacitors; Stock 1: 5760; Pricing 1: 1=0.79, 10=0.663, 50=0.4752, 100=0.4158, 250=0.32672, 500=0.297, 1000=0.2376 (USD); Voltage - Rated: 4V; Tolerance: ±20%; Temperature Coefficient: X5R; Mounting Type: Surface Mount, MLCC; Operating Temperature: -55°C ~ 85°C; Applications: General Purpose; Ratings: -; Package / Case: 0603 (1608 Metric); Size / Dimension: 0.063" L x 0.031" W (1.60mm x 0.80mm); Height - Seated (Max): -; Thickness (Max): 0.035" (0.90mm); Lead Spacing: -; Features: -; Packaging: Cut Tape (CT); Lead Style: -; ComponentLink1URL: http://www.murata.com/products/catalog/pdf/c02e.pdf; ComponentLink1Description: http://www.murata.com/products/catalog/pdf/c02e.pdf; .Checked SCH: used
C327 C328 = C0603C0G1H2R2C030BA: CAP CER 2.2PF 50V C0G 0201; Manufacturer: TDK Corporation; Tolerance: ±0.25pF; Temperature Coefficient: C0G, NP0; .Checked PCB: MM; Supplier 1: Digi-Key; Manufacturer Part Number: C0603C0G1H2R2C030BA; RoHS: RoHS Compliant; Category: Capacitors; Stock 1: 90496; Pricing 1: 1=0.1, 10=0.027, 100=0.0123, 250=0.01008, 500=0.00864, 1000=0.0066, 5000=0.0055 (USD); Packaging: Cut Tape (CT); Capacitance: 2.2pF; Voltage - Rated: 50V; Mounting Type: Surface Mount, MLCC; Operating Temperature: -55°C ~ 125°C; Applications: General Purpose; Ratings: -; Package / Case: 0201 (0603 Metric); Size / Dimension: 0.024" L x 0.012" W (0.60mm x 0.30mm); Height - Seated (Max): -; Thickness (Max): 0.013" (0.33mm); Lead Spacing: -; Features: -; Lead Style: -; ComponentLink1URL: http://product.tdk.com/en/catalog/datasheets/mlcc_commercial_general_en.pdf; ComponentLink1Description: http://product.tdk.com/en/catalog/datasheets/mlcc_commercial_general_en.pdf; Supplier Part Number 1: 445-1771-1-ND; .Checked SCH: MM; .Creator: MM
C392 C393 = C1005X5R1H104K: CAP CER .10UF 50V X5R 10% 0402; Manufacturer: TDK Corporation; Capacitance: 0.1µF; Value: 100nF; .Checked PCB: used; Category: Capacitors; Supplier Part Number: 445-5942-1-ND; Manufacturer Part Number: C1005X5R1H104K; Operating Temperature: -55°C ~ 85°C; Package / Case: 0402 (1005 Metric); Price 1k [$]: 0.02340; .Checked SCH: used; Voltage - Rated: 50V; Supplier: Digikey; Supplier 1: Digi-Key; Supplier Part Number 1: 445-5942-1-ND; RoHS: RoHS Compliant; Stock 1: 106926; Pricing 1: 1=0.27, 10=0.18, 100=0.072, 250=0.05176, 500=0.0369, 1000=0.027 (USD); Tolerance: ±10%; Temperature Coefficient: X5R; Mounting Type: Surface Mount, MLCC; Applications: General Purpose; Ratings: -; Size / Dimension: 0.039" L x 0.020" W (1.00mm x 0.50mm); Height - Seated (Max): -; Thickness (Max): 0.022" (0.55mm); Lead Spacing: -; Features: -; Packaging: Cut Tape (CT); Lead Style: -; ComponentLink1URL: http://www.tdk.co.jp/tefe02/e412_c.pdf; ComponentLink1Description: http://www.tdk.co.jp/tefe02/e412_c.pdf
R1-R3 R11 R12 R22 R31 R34 R38-R40 R42 R44 R45 R50 R66 R72 R77 R79 R103 R105-R108 R111 = MCR006YRTF47R0: RES SMD 47 OHM 1% 1/20W 0201; Manufacturer: Rohm Semiconductor; Resistance (Ohms): 47; Power (Watts): 0.05W, 1/20W; Temperature Coefficient: ±250ppm/°C; .Creator: MM; Supplier 1: Digi-Key; Manufacturer Part Number: MCR006YRTF47R0; RoHS: RoHS Compliant; Category: Resistors; Stock 1: 28822; Pricing 1: 1=0.1, 10=0.051, 25=0.0368, 100=0.0208, 250=0.01584, 500=0.01268, 1000=0.00933, 5000=0.00669 (USD); Packaging: Cut Tape (CT); Tolerance: ±1%; Composition: Thick Film; Features: -; Operating Temperature: -55°C ~ 125°C; Package / Case: 0201 (0603 Metric); Supplier Device Package: 0201 (0603 Metric); Size / Dimension: 0.024" L x 0.012" W (0.60mm x 0.30mm); Height: 0.010" (0.26mm); Number of Terminations: 2; ComponentLink1URL: http://rohmfs.rohm.com/en/products/databook/datasheet/passive/resistor/chip_resistor/mcr_g.pdf; ComponentLink1Description: http://rohmfs.rohm.com/en/products/databook/datasheet/passive/resistor/chip_resistor/mcr_g.pdf; Supplier Part Number 1: RHM47CBCT-ND; .Checked PCB: MM; .Checked SCH: MM
R4 R5 R8-R10 R306-R309 = RMCF0201FT240R: RES 240 OHM 1/20W 1% 0201; Manufacturer: Stackpole Electronics Inc; Resistance (Ohms): 240; Power (Watts): 0.05W, 1/20W; Temperature Coefficient: ±200ppm/°C; .Creator: MM; Supplier 1: Digi-Key; Manufacturer Part Number: RMCF0201FT240R; RoHS: RoHS Compliant; Category: Resistors; Stock 1: 37080; Pricing 1: 1=0.12, 10=0.084, 50=0.046, 100=0.035, 250=0.026, 500=0.0192, 1000=0.0128, 2500=0.0108, 5000=0.009 (USD); Packaging: Cut Tape (CT); Tolerance: ±1%; Composition: Thick Film; Features: -; Package / Case: 0201 (0603 Metric); Supplier Device Package: 0201; Size / Dimension: 0.024" L x 0.012" W (0.60mm x 0.30mm); Height: 0.009" (0.24mm); Number of Terminations: 2; ComponentLink1URL: http://www.seielect.com/Catalog/SEI-RMCF_RMCP.pdf; ComponentLink1Description: http://www.seielect.com/Catalog/SEI-RMCF_RMCP.pdf; Supplier Part Number 1: RMCF0201FT240RCT-ND; .Checked PCB: MM; .Checked SCH: MM
R6 R7 = RC0201FR-0710KL: RES 10K OHM 1/20W 1% 0201 SMD; Manufacturer: Yageo; Power (Watts): 0.05W, 1/20W; Temperature Coefficient: ±200ppm/°C; .Creator: MM; Supplier 1: Digi-Key; Manufacturer Part Number: RC0201FR-0710KL; RoHS: RoHS Compliant; Category: Resistors; Stock 1: 529049; Pricing 1: 1=0.1, 10=0.074, 25=0.054, 100=0.0303, 250=0.02312, 500=0.0185, 1000=0.01361, 2500=0.01182, 5000=0.00976 (USD); Packaging: Cut Tape (CT); Resistance (Ohms): 10k; Tolerance: ±1%; Composition: Thick Film; Features: Moisture Resistant; Package / Case: 0201 (0603 Metric); Supplier Device Package: 0201; Size / Dimension: 0.024" L x 0.012" W (0.60mm x 0.30mm); Height: 0.010" (0.26mm); Number of Terminations: 2; ComponentLink1URL: http://www.yageo.com/documents/recent/PYu-RC0201_51_RoHS_L_8.pdf; ComponentLink1Description: http://www.yageo.com/documents/recent/PYu-RC0201_51_RoHS_L_8.pdf; Supplier Part Number 1: 311-10.0KMCT-ND; .Checked PCB: MM; .Checked SCH: MM
R112 R113 R253 R256 = MCR006YRTF49R9: RES 49.9 OHM 1/20W 1% 0201 SMD; Manufacturer: Rohm Semiconductor; Resistance (Ohms): 49.9; Power (Watts): 0.05W, 1/20W; Temperature Coefficient: ±250ppm/°C; .Creator: MM; Supplier 1: Digi-Key; Manufacturer Part Number: MCR006YRTF49R9; RoHS: RoHS Compliant; Category: Resistors; Stock 1: 52679; Pricing 1: 1=0.1, 10=0.051, 25=0.0368, 100=0.0208, 250=0.01584, 500=0.01268, 1000=0.00933, 5000=0.00669 (USD); Packaging: Cut Tape (CT); Tolerance: ±1%; Composition: Thick Film; Features: -; Package / Case: 0201 (0603 Metric); Supplier Device Package: 0201 (0603 Metric); Size / Dimension: 0.024" L x 0.012" W (0.60mm x 0.30mm); Height: 0.010" (0.26mm); Number of Terminations: 2; ComponentLink1URL: http://rohmfs.rohm.com/en/products/databook/datasheet/passive/resistor/chip_resistor/mcr_g.pdf; ComponentLink1Description: http://rohmfs.rohm.com/en/products/databook/datasheet/passive/resistor/chip_resistor/mcr_g.pdf; Supplier Part Number 1: RHM49.9CBCT-ND; .Checked PCB: MM; .Checked SCH: MM
R245 R274 = RMCF0402FT240R: RES TF 240 OHM 1% 0.0625W 0402; Manufacturer: Stackpole Electronics Inc; Resistance (Ohms): 240; Power (Watts): 0.063W, 1/16W; .Checked PCB: used; Temperature Coefficient: ±100ppm/°C; Category: Resistors; Supplier Part Number: RMCF0402FT240RCT-ND; Manufacturer Part Number: RMCF0402FT240R; Package / Case: 0402 (1005 Metric); Price 1k [$]: 0.00384; Tolerance: ±1%; Value: 240R; .Checked SCH: used; Supplier: Digikey; Supplier 1: Digi-Key; Supplier Part Number 1: RMCF0402FT240RCT-ND; RoHS: RoHS Compliant; Stock 1: 39860; Pricing 1: 1=0.04, 10=0.025, 50=0.0138, 100=0.0105, 250=0.0078, 500=0.00576, 1000=0.00384 (USD); Composition: Thick Film; Features: -; Size / Dimension: 0.039" L x 0.020" W (1.00mm x 0.50mm); Height: 0.016" (0.40mm); Number of Terminations: 2; Packaging: Cut Tape (CT); ComponentLink1URL: http://www.seielect.com/Catalog/SEI-RMCF.pdf; ComponentLink1Description: http://www.seielect.com/Catalog/SEI-RMCF.pdf
U1 = MCIMX6Q5EYM10AC_v.ORX: IC MCU 32BIT ARM QUAD 624FCBGA; Manufacturer: Freescale Semiconductor; Core Processor: ARM® Cortex™-A9; Core Size: 32-Bit Quad-Core; Speed: 1.0GHz; Connectivity: CAN, EBI/EMI, ESAI, Ethernet, GPMI, I2C, MMC/SD, PCI, SATA, SPI, UART, USB, USB OTG; Peripherals: DMA, HDMI, I2S/SSI/AC97, MIPI CSI, MIMI DSI, MIPI HIS, PWM, WDT; Number of I /O: 224; Program Memory Type: External Program Memory; RAM Size: 256K x 8; Voltage - Supply (Vcc/Vdd): 0.925 V ~ 1.5 V; Oscillator Type: Internal; .Creator: MM; .Checked PCB: MM, checked by RF; Supplier 1: Digi-Key; Manufacturer Part Number: MCIMX6Q5EYM10AC; RoHS: RoHS Compliant; Category: Integrated Circuits (ICs); Stock 1: 0; Pricing 1: 1=54.98, 10=51.922, 25=48.868, 100=30.5424 (USD); Program Memory Size: -; EEPROM Size: -; Data Converters: -; Operating Temperature: -20°C ~ 105°C; Package / Case: 624-FBGA, FCBGA; Packaging: Tray; ComponentLink1URL: http://cache.freescale.com/files/32bit/doc/data_sheet/IMX6DQCEC.pdf; ComponentLink1Description: http://cache.freescale.com/files/32bit/doc/data_sheet/IMX6DQCEC.pdf; Supplier Part Number 1: MCIMX6Q5EYM10AC-ND
U2-U5 = MT41J256M16HA-125:E: IC DDR3 SDRAM 4GBIT 800MHZ FBGA; Manufacturer: Micron Technology Inc; Format - Memory: RAM; Memory Size: 4G (256M x 16); Interface: Parallel; Voltage - Supply: 1.425 V ~ 1.575 V; .Creator: MM; Supplier 1: Digi-Key; Manufacturer Part Number: MT41J256M16HA-125:E; RoHS: RoHS Compliant; Category: Integrated Circuits (ICs); Stock 1: 0; Pricing 1: 1000=7.1775 (USD); Packaging: Tray; Memory Type: DDR3 SDRAM; Speed: 800MHz; Operating Temperature: 0°C ~ 95°C; Package / Case: 96-TFBGA; Supplier Device Package: 96-FBGA (9x14); ComponentLink1URL: http://www.micron.com/~/media/Documents/Products/Data%20Sheet/DRAM/DDR3/4Gb_DDR3_SDRAM.pdf; ComponentLink1Description: http://www.micron.com/~/media/Documents/Products/Data%20Sheet/DRAM/DDR3/4Gb_DDR3_SDRAM.pdf; Supplier Part Number 1: MT41J256M16HA-125:E-ND; .Checked PCB: MM; .Checked SCH: MM